# EAGLE design EEprom_Logger_V1_2019_11_11A (EAGLE 9.4.2)
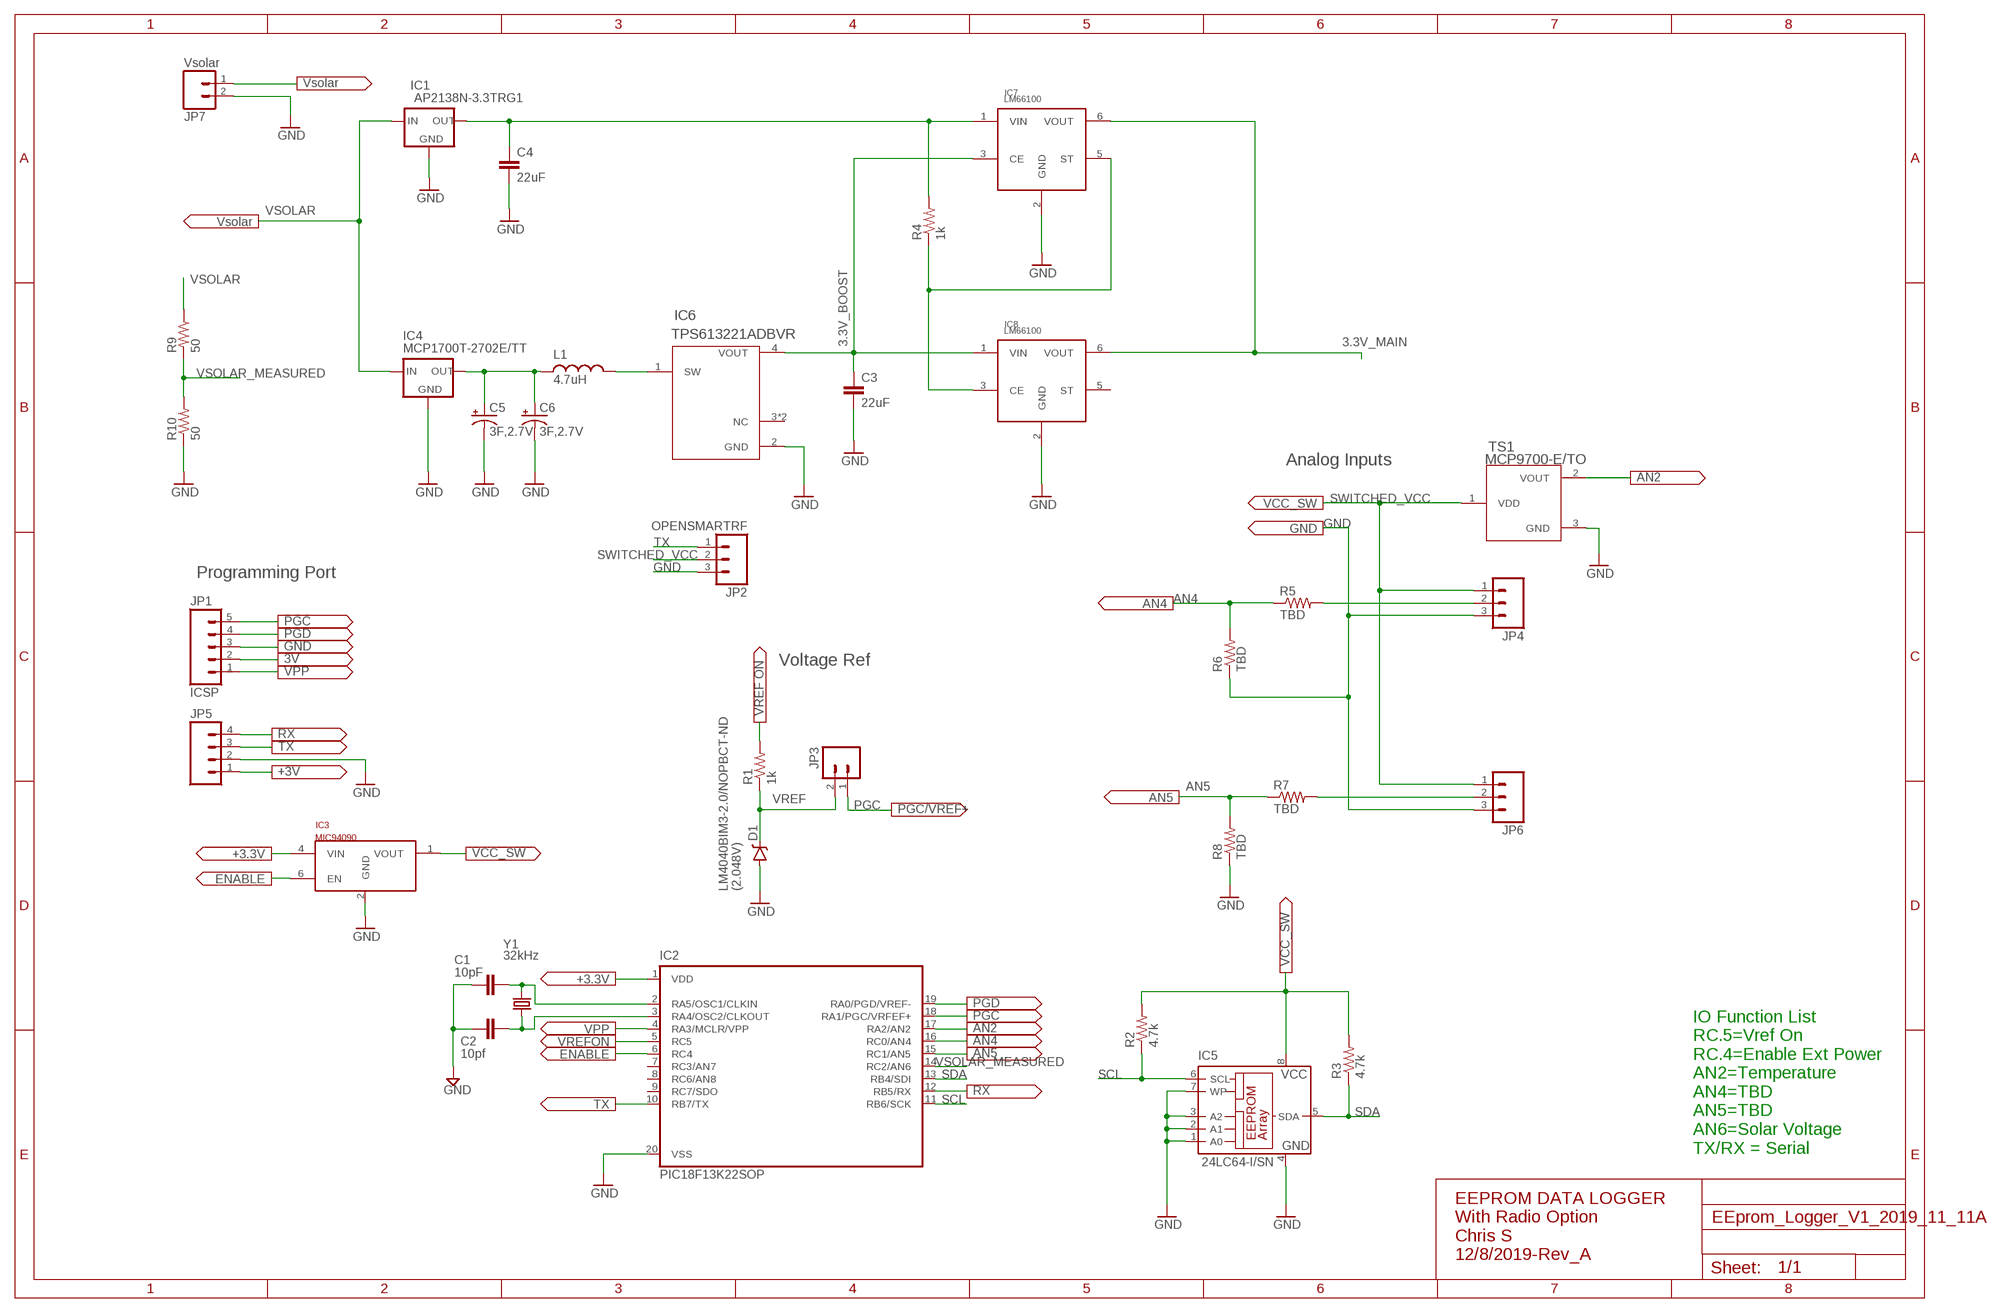
[diagram p0: schematic, sheet 1]

## Parts
C1  10pF  CAP1206  [1206]
C2  10pf  CAP1206  [1206]
C3  22uF  CAP1206  [1206]
C4  22uF  CAP1206  [1206]
C5  3F,2.7V  CPOL-USE3.5-8  [E3,5-8]
C6  3F,2.7V  CPOL-USE3.5-8  [E3,5-8]
D1  V-REFERENCESMD  [SOT23-3]
IC1  AP2138N-3.3TRG1  XC63FPM  [SOT23]
IC2  PIC18F13K22SOP  [SOP20W]
IC3  MIC94090  [SC-70]
IC4  MCP1700T-2702E/TT  XC63FPM  [SOT23]
IC5  24LC64-I/SN  24LC16BSN  [SO-08]
IC6  TPS613221ADBVR  TPS61322  [DBV5-L]
IC7  LM66100  [SC70-6]
IC8  LM66100  [SC70-6]
JP1  ICSP  M05PTH  [1X05]
JP2  OPENSMARTRF  M03LONGPADS  [1X03_LONGPADS@1]
JP3  M02LOCK  [1X02_LOCK]
JP4  455-1750-1-ND  CONN_03  [1X03]
JP5  M04PTH  [1X04]
JP6  455-1750-1-ND  CONN_03  [1X03]
JP7  Vsolar  CONN_02POLAR_LOCK  [MOLEX-1X2_LOCK@1]
L1  4.7uH  INDUCTOR1210  [1210]
R1  1k  RESISTOR1206  [1206]
R2  4.7k  RESISTOR1206  [1206]
R3  4.7k  RESISTOR1206  [1206]
R4  1k  RESISTOR1206  [1206]
R5  TBD  RESISTOR1206  [1206]
R6  TBD  RESISTOR1206  [1206]
R7  TBD  RESISTOR1206  [1206]
R8  TBD  RESISTOR1206  [1206]
R9  50  RESISTOR1206  [1206]
R10  50  RESISTOR1206  [1206]
TS1  MCP9700-E/TO  [TO-92-AMMO]
Y1  32kHz  CRYSTALTC26V  [TC26V]

## Nets
3.3V_BOOST: C3.2 IC6.4(VOUT) IC7.3(CE) IC8.1(VIN)
3.3V_MAIN: IC2.1(VDD) IC3.4(VIN) IC7.6(VOUT) IC8.6(VOUT) JP1.2 JP5.1
AN2: IC2.17(RA2/AN2) TS1.2(VOUT)
AN4: IC2.16(RC0/AN4) R5.1 R6.2
AN5: IC2.15(RC1/AN5) R7.1 R8.2
ENABLE: IC2.6(RC4) IC3.6(EN)
GND: C1.2 C2.2 C3.1 C4.1 C5.- C6.- D1.2(A) IC1.1(GND) IC2.20(VSS) IC3.2(GND) IC4.1(GND) IC5.1(A0) IC5.2(A1) IC5.3(A2) IC5.4(GND) IC5.7(WP) IC6.2(GND) IC7.2(GND) IC8.2(GND) JP1.3 JP2.3 JP4.3 JP5.2 JP6.3 JP7.2 R6.1 R8.1 R10.1 TS1.3(GND)
N$1: C1.1 IC2.2(RA5/OSC1/CLKIN) Y1.2
N$2: C2.1 IC2.3(RA4/OSC2/CLKOUT) Y1.1
N$3: C4.2 IC1.2(OUT) IC7.1(VIN) R4.2
N$4: C5.+ C6.+ IC4.2(OUT) L1.1
N$6: IC7.5(ST) IC8.3(CE) R4.1
N$7: JP4.2 R5.2
N$10: IC6.1(SW) L1.2
N$12: JP6.2 R7.2
PGC: IC2.18(RA1/PGC/VRFEF+) JP1.5 JP3.1
PGD: IC2.19(RA0/PGD/VREF-) JP1.4
RX: IC2.12(RB5/RX) JP5.4
SCL: IC2.11(RB6/SCK) IC5.6(SCL) R2.1
SDA: IC2.13(RB4/SDI) IC5.5(SDA) R3.1
SWITCHED_VCC: IC3.1(VOUT) IC5.8(VCC) JP2.2 JP4.1 JP6.1 R2.2 R3.2 TS1.1(VDD)
TX: IC2.10(RB7/TX) JP2.1 JP5.3
VPP: IC2.4(RA3/MCLR/VPP) JP1.1
VREF: D1.1(C) JP3.2 R1.1
VREFON: IC2.5(RC5) R1.2
VSOLAR: IC1.3(IN) IC4.3(IN) JP7.1 R9.1
VSOLAR_MEASURED: IC2.14(RC2/AN6) R9.2 R10.2
Unconnected: IC2.7(RC3/AN7) IC2.8(RC6/AN8) IC2.9(RC7/SDO) IC6.3(NC) IC6.5(NC) IC8.5(ST)

## Notes on the sheet
- Analog Inputs
- Programming Port
- Voltage Ref
- LM4040BIM3-2.0/NOPBCT-ND
  (2.048V)
- IO Function List
  RC.5=Vref On
  RC.4=Enable Ext Power
  AN2=Temperature
  AN4=TBD
  AN5=TBD
  AN6=Solar Voltage
  TX/RX = Serial
- EEPROM DATA LOGGER
  With Radio Option
  Chris S
  12/8/2019-Rev_A

## Library data of the parts
C1-C4 = SparkFun-Capacitors:CAP: Capacitor Standard 0603 ceramic capacitor, and 0.1" leaded capacitor.
C5 C6 = rcl:CPOL-US: POLARIZED CAPACITOR, American symbol; SPICEPREFIX: C
D1 = SparkFun-DiscreteSemi:V-REFERENCE: Zener diode
IC1 IC4 = v-reg:XC63FP: Positiv Voltage Regulators www.torex.co.jp/english/product/pro02/pdf/0201_xc62fp.pdf
IC2 = PIC18F13k22:PIC18F13K22?: 18/20/28-Pin High-Performance, Enhanced Flash Microcontrollers with 10-bit A/D and nanoWatt Technology Source: ww1.microchip.com/downloads/en/DeviceDoc/39605c.pdf
IC3 = MIC94090:MIC94090: MIC94090 Load switch 130mOhm ON 1.2A Conti. Current
IC5 = microchip:24*: Serial EEPROM I2C; MF: MICROCHIP; MPN: 24LC16B/SN; OC_FARNELL: 9757945; OC_NEWARK: 12C2012
IC6 = ‎TPS613221:TPS61322
IC7 IC8 = LM66100:LM66100
JP1 = SparkFun-Connectors:M05: Header 5 Standard 5-pin 0.1" header. Use with straight break away headers (SKU : PRT-00116), right angle break away headers (PRT-00553), swiss pins (PRT-00743), machine pins (PRT-00117), and female headers (PRT-00115). Molex polarized connector foot print use with SKU : PRT-08230 with associated crimp pins and housings.
JP2 = SparkFun-Connectors:M03: Header 3 Standard 3-pin 0.1" header. Use with straight break away headers (SKU : PRT-00116), right angle break away headers (PRT-00553), swiss pins (PRT-00743), machine pins (PRT-00117), and female headers (PRT-00115). Molex polarized connector foot print use with SKU : PRT-08232 with associated crimp pins and housings.
JP3 = SparkFun-Connectors:M02: Standard 2-pin 0.1" header. Use with - straight break away headers ( PRT-00116) - right angle break away headers (PRT-00553) - swiss pins (PRT-00743) - machine pins (PRT-00117) - female headers (PRT-00115) Molex polarized connector foot print use with: PRT-08233 with associated crimp pins and housings. 2.54_SCREWTERM for use with PRT-10571. 3.5mm Screw Terminal footprints for PRT-08084 5mm Screw Terminal footprints for use with PRT-08432
JP4 JP6 = SparkFun-Connectors:CONN_03: Multi connection point. Often used as Generic Header-pin footprint for 0.1 inch spaced/style header connections On any of the 0.1 inch spaced packages, you can populate with these: Break Away Headers - Straight <https://www.sparkfun.com/products/116> (PRT-00116) Break Away Male Headers - Right Angle <https://www.sparkfun.com/products/553> (PRT-00553) Female Headers <https://www.sparkfun.com/products/115> (PRT-00115) Break Away Headers - Machine Pin <https://www.sparkfun.com/products/117> (PRT-00117) Break Away Female Headers - Swiss Machine Pin <https://www.sparkfun.com/products/743> (PRT-00743) Stackable Header - 3 Pin (Female, 0.1") <https://www.sparkfun.com/products/13875> (PRT-13875) For SCREWTERMINALS and SPRING TERMINALS visit here: Screw Terimnals on SparkFun.com <https://www.sparkfun.com/search/results?term=Screw+Terminals> (5mm/3.5mm/2.54mm spacing) This device is also useful as a general connection point to wire up your design to another part of your project. Our various solder wires solder well into these plated through hole pads. Hook-Up Wire - Assortment (Stranded, 22 AWG) <https://www.sparkfun.com/products/11375> (PRT-11375) Hook-Up Wire - Assortment (Solid Core, 22 AWG) <https://www.sparkfun.com/products/11367> (PRT-11367) View the entire wire category on our website here <https://www.sparkfun.com/categories/141> Special notes: Molex polarized connector foot print use with SKU : PRT-08232 with associated crimp pins and housings.; PROD_ID: XXX-00000
JP5 = SparkFun-Connectors:M04: Header 4 Standard 4-pin 0.1" header. Use with straight break away headers (SKU : PRT-00116), right angle break away headers (PRT-00553), swiss pins (PRT-00743), machine pins (PRT-00117), and female headers (PRT-00115). Molex polarized connector foot print use with SKU : PRT-08231 with associated crimp pins and housings. 1MM SMD Version SKU: PRT-10208
JP7 = SparkFun-Connectors:CONN_02: Multi connection point. Often used as Generic Header-pin footprint for 0.1 inch spaced/style header connections On any of the 0.1 inch spaced packages, you can populate with these: Break Away Headers - Straight <https://www.sparkfun.com/products/116> (PRT-00116) Break Away Male Headers - Right Angle <https://www.sparkfun.com/products/553> (PRT-00553) Female Headers <https://www.sparkfun.com/products/115> (PRT-00115) Break Away Headers - Machine Pin <https://www.sparkfun.com/products/117> (PRT-00117) Break Away Female Headers - Swiss Machine Pin <https://www.sparkfun.com/products/743> (PRT-00743) For SCREWTERMINALS and SPRING TERMINALS visit here: Screw Terimnals on SparkFun.com <https://www.sparkfun.com/search/results?term=Screw+Terminals> (5mm/3.5mm/2.54mm spacing) This device is also useful as a general connection point to wire up your design to another part of your project. Our various solder wires solder well into these plated through hole pads. Hook-Up Wire - Assortment (Stranded, 22 AWG) <https://www.sparkfun.com/products/11375> (PRT-11375) Hook-Up Wire - Assortment (Solid Core, 22 AWG) <https://www.sparkfun.com/products/11367> (PRT-11367) View the entire wire category on our website here <https://www.sparkfun.com/categories/141> Special notes: Molex polarized connector foot print use with: PRT-08233 with associated crimp pins and housings. 2.54_SCREWTERM for use with PRT-10571. 3.5mm Screw Terminal footprints for PRT-08084 5mm Screw Terminal footprints for use with PRT-08432; SF_ID: PRT-09918
L1 = SparkFun-Passives:INDUCTOR: Inductors Basic Inductor/Choke - 0603 and 1206. Footprints are not proven and vary greatly between part numbers. SRN6045- 33uH, 20% 1.4A SDR0403-560KL - 56uH, 10%, 500mA RMS/740mA peak
R1-R10 = SparkFun-Resistors:RESISTOR: Resistor Basic schematic elements and footprints for 0603, 1206, and PTH resistors.
TS1 = MCP970X_Temp Sensors:MCP9700-E/TO
Y1 = crystal:CRYSTAL: CRYSTAL; OC_FARNELL: unknown; OC_NEWARK: unknown

## Board
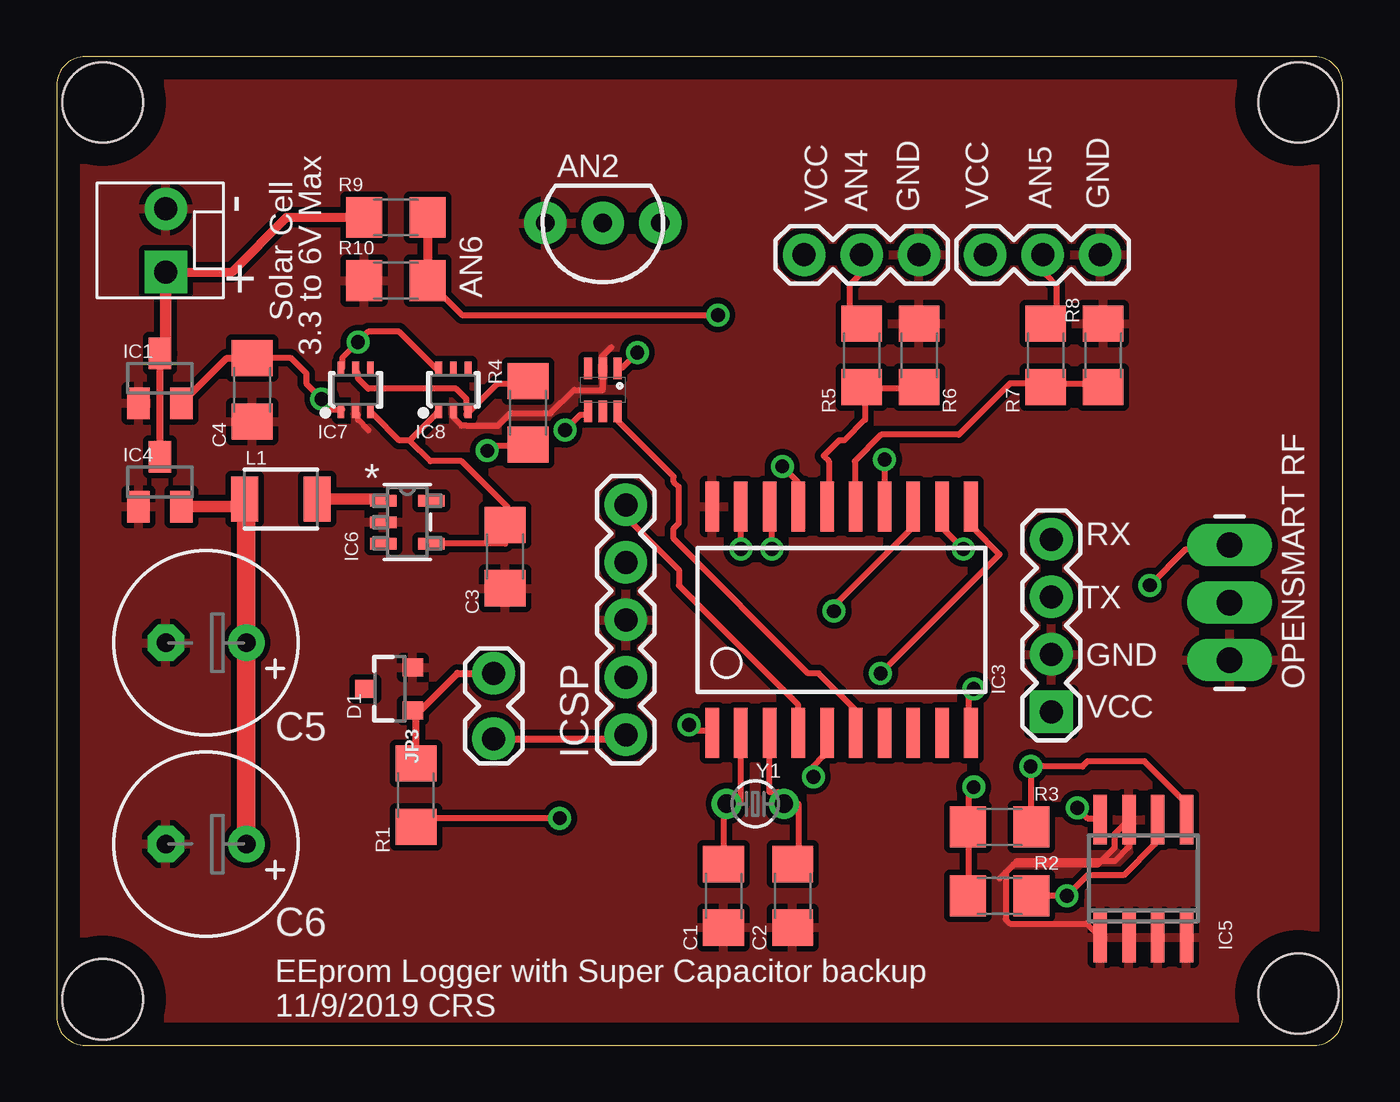
[diagram p1: board, top side]
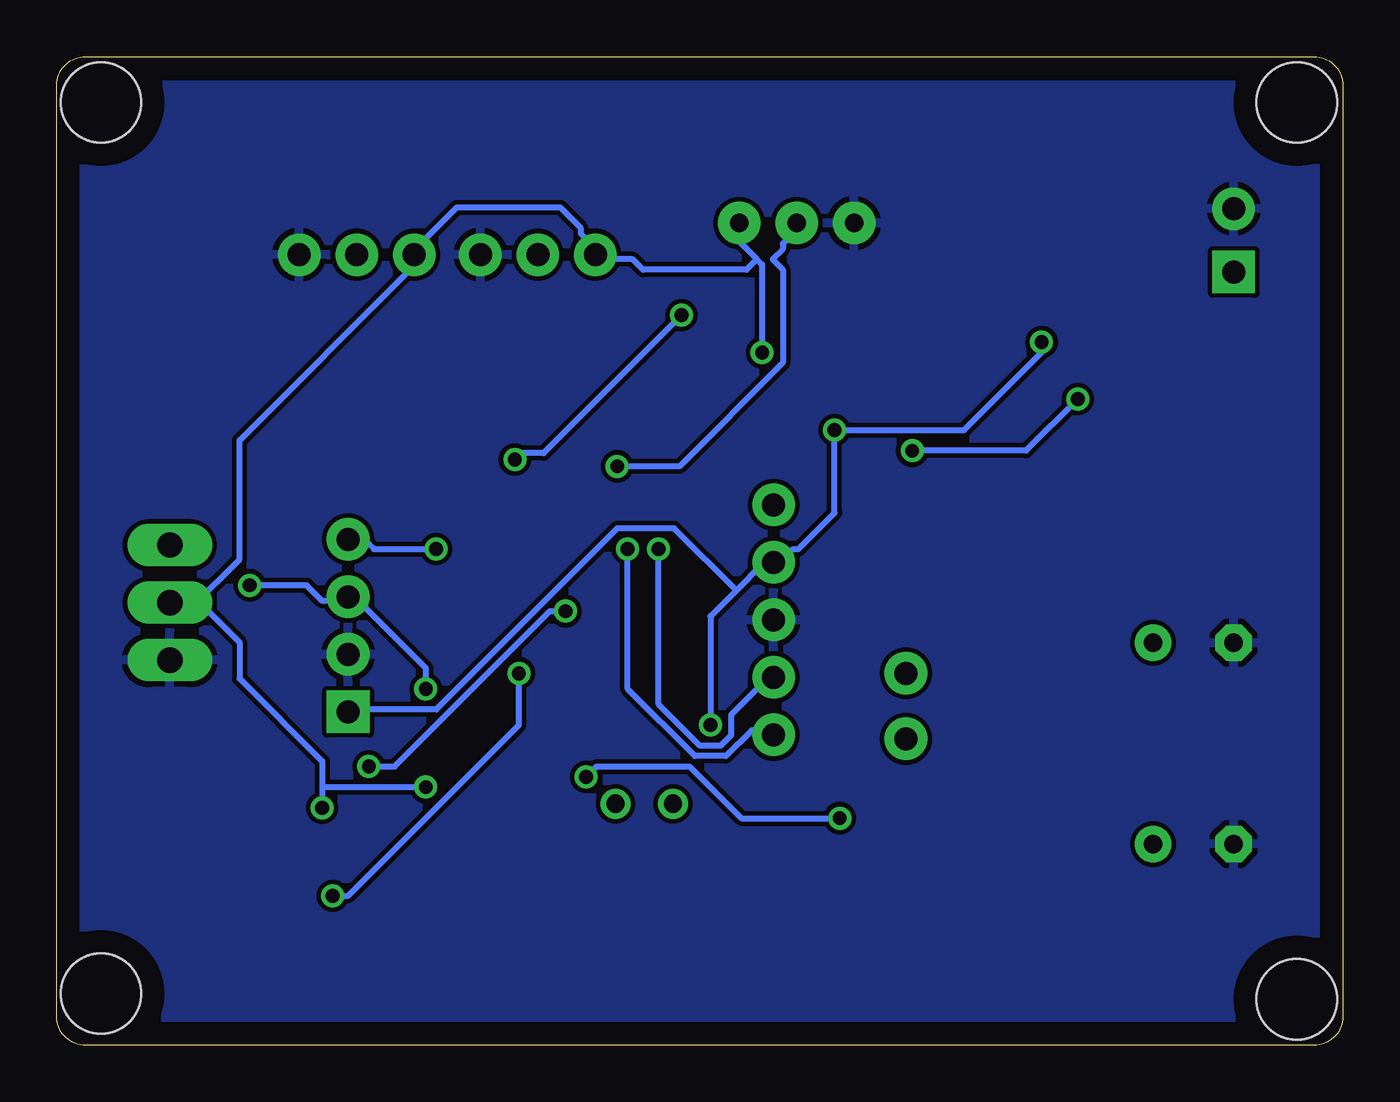
[diagram p2: board, bottom side, seen from below]

Size 56.82 x 43.68 mm. Coordinates in mm from the lower left corner, seen from the top.
Outline: 0,42.41 0,1.27 arc90 1.27,0 55.55,0 arc90 56.82,1.27 56.82,42.41 arc90 55.55,43.68 1.27,43.68 arc90 0,42.41
Copper layers (1*16): Top 0.035mm / dielectric 1.5mm / Bottom 0.035mm
Design rules "default": minimum track width 10mil, minimum drill 24mil, track to track 8mil, track to pad 8mil, pad to pad 8mil, via to via 8mil, smd to smd 8mil, copper to edge 40mil, drill to drill 8mil, minimum pad ring 10mil, minimum via ring 8mil, stop-mask expansion 4mil, vias tented up to drill 0mil, thermal gap 10mil
Holes 3.56 mm at 2.03,41.66 54.86,41.66 54.86,2.29 2.03,2.03

### Footprints (pad centres in the part's own frame; a part is rotated, then mirrored left to right if it is on the bottom)
1206 = smd 1.6 x 1.8: 1 -1.4,0; 2 1.4,0
E3,5-8 = drill 0.813 pad 1.6: + -1.778,0 | drill 0.813 pad 1.6 octagon: - 1.778,0
SOT23-3 = smd 0.8 x 0.9: 1 -0.95,-1; 2 0.95,-1; 3 0,1.1
SOT23 = smd 1 x 1.4: 1 -0.95,-1.1; 2 0.95,-1.1; 3 0,1.1
SOP20W = smd 0.6 x 2.2: 1 -5.715,-5; 2 -4.445,-5; 3 -3.175,-5; 4 -1.905,-5; 5 -0.635,-5; 6 0.635,-5; 7 1.905,-5; 8 3.175,-5; 9 4.445,-5; 10 5.715,-5; 11 5.715,5; 12 4.445,5; 13 3.175,5; 14 1.905,5; 15 0.635,5; 16 -0.635,5; 17 -1.905,5; 18 -3.175,5; 19 -4.445,5; 20 -5.715,5
SC-70 = smd 0.36 x 0.95: 1 -0.65,-0.95; 2 0,-0.95; 3 0.65,-0.95; 4 0.65,0.95; 5 0,0.95; 6 -0.65,0.95
SO-08 = smd 0.6 x 2.2: 1 -1.905,-2.6; 2 -0.635,-2.6; 3 0.635,-2.6; 4 1.905,-2.6; 5 1.905,2.6; 6 0.635,2.6; 7 -0.635,2.6; 8 -1.905,2.6
DBV5-L = smd 1.168 x 0.508: 1 -1.067,0.95; 2 -1.067,0; 3 -1.067,-0.95; 4 1.067,-0.95; 5 1.067,0.95
SC70-6 = smd 0.3 x 0.66: 1 -0.65,-0.92; 2 0,-0.92; 3 0.65,-0.92; 4 0.65,0.92; 5 0,0.92; 6 -0.65,0.92
1X05 = drill 1.016 pad 1.88: 1 0,0; 2 2.54,0; 3 5.08,0; 4 7.62,0; 5 10.16,0
1X03_LONGPADS@1 = drill 1.118 pad 1.88 long: 1 0,0; 2 2.54,0; 3 5.08,0
1X02_LOCK = drill 1.016 pad 1.88: 1 -0.178,0; 2 2.718,0
1X03 = drill 1.016 pad 1.88: 1 0,0; 2 2.54,0; 3 5.08,0
1X04 = drill 1.016 pad 1.88 square: 1 0,0 | drill 1.016 pad 1.88: 2 2.54,0; 3 5.08,0; 4 7.62,0
MOLEX-1X2_LOCK@1 = drill 1.016 pad 1.88 square: 1 -0.127,0 | drill 1.016 pad 1.88: 2 2.667,0
1210 = smd 1.2 x 2: 1 -1.6,0; 2 1.6,0
TO-92-AMMO = drill 0.813 pad 1.88: 1 -2.54,0; 2 0,0; 3 2.54,0
TC26V = drill 0.813: 1 -1.27,0; 2 1.27,0

### Placement (x,y rotation side)
C1  29.46,6.6 270 top
C2  32.51,6.6 270 top
C3  19.81,21.59 90 top
C4  8.64,28.96 90 top
C5  6.6,17.78 180 top
C6  6.6,8.89 180 top
D1  14.73,15.75 90 top
IC1  4.57,29.46 0 top
IC2  34.67,18.8 0 top
IC3  24.13,28.96 180 top
IC4  4.57,24.89 0 top
IC5  48.01,7.37 0 top
IC6  15.49,23.11 0 top
IC7  13.21,28.96 0 top
IC8  17.53,28.96 0 top
JP1  25.15,23.88 270 top
JP2  51.82,22.1 270 top
JP3  19.3,13.72 90 top
JP4  33.02,34.93 0 top
JP5  43.94,14.73 90 top
JP6  41.02,34.93 0 top
JP7  4.83,34.29 90 top
L1  9.91,24.13 0 top
R1  15.87,11.05 270 top
R2  41.66,6.6 180 top
R3  41.66,9.65 180 top
R4  20.83,27.94 270 top
R5  35.56,30.48 90 top
R6  38.1,30.48 270 top
R7  43.69,30.48 90 top
R8  46.23,30.48 270 top
R9  14.99,36.58 0 top
R10  14.99,33.78 0 top
TS1  24.13,36.32 180 top
Y1  30.86,10.67 180 top

### Tracks (layer width: path | path; a pad name or v marks a point on that pad's centre or on a via)
3.3V_BOOST
  Top 0.254: IC6.4 19.81,22.16 C3.2 19.94,23.06 19.94,23.75 17.88,25.81 16.51,25.81 15.6,26.72 | 15.6,26.72 15.14,26.72 13.99,27.86 IC7.3 | 15.6,26.72 16.74,27.86 IC8.1
3.3V_MAIN  (via drill 0.61)
  Top 0.254: IC7.6 12.62,29.92 12.62,30.38 v13.31,31.06 13.77,31.52 15.14,31.52 16.74,29.92 IC8.6 | v22.45,27.18 23.14,27.86 23.37,27.86 IC3.4 | v27.94,14.15 28.17,13.92 28.85,13.92 IC2.1
  Bottom 0.254: v27.94,14.15 27.94,18.95 26.8,20.09 | 26.8,20.09 25.65,21.23 25.2,21.23 JP1.2 24.97,21.23 24.28,21.92 24.05,21.92 22.45,23.52 v22.45,27.18 16.74,27.18 13.08,30.84 13.08,31.06 v13.31,31.06 | 26.8,20.09 29.54,22.84 32.05,22.84 40.06,14.83 43.94,14.83 JP5.1
AN2  (via drill 0.61)
  Top 0.254: v32.05,25.58 32.74,24.89 32.74,23.98 IC2.17
  Bottom 0.254: v32.05,25.58 29.31,25.58 24.74,30.15 24.74,34.27 25.2,34.72 24.74,35.18 24.74,35.41 24.28,35.87 24.28,36.32 TS1.2
AN4
  Top 0.254: 35.71,29.01 38,29.01 R6.2 | 35.71,29.01 R5.1 35.71,29.01 | 35.71,29.01 35.71,27.63 34.8,26.72 34.57,26.72 33.88,26.04 34.11,25.81 34.11,23.98 IC2.16
AN5
  Top 0.254: R8.2 46.23,29.21 43.71,29.21 R7.1 43.48,29.23 42.11,29.23 39.85,26.98 36.42,26.98 35.26,25.81 35.26,23.98 IC2.15
ENABLE
  Top 0.254: IC3.6 24.74,27.86 24.74,27.63 27.25,25.12 27.25,24.89 27.48,24.66 27.48,23.06 27.25,22.84 27.25,22.38 33.2,16.43 33.66,16.43 35.26,14.83 35.26,13.92 IC2.6
GND
  Top 0.254: 13.77,27.18 13.31,27.63 13.31,27.86 IC7.2 | 24.51,30.84 24.05,30.38 24.05,29.92 IC3.2 24.13,28.96 22.86,28.96 21.83,27.92 20.05,27.92 19.5,27.38 18.14,27.38 18.12,27.37 18.11,27.38 17.89,27.38 17.53,27.74 IC8.2 | 41.66,7.37 42.41,8.13 46.74,8.13 47.37,8.76 IC5.7 46.73,9.33 46.73,8.73 45.98,7.98 42.26,7.98 41.93,7.64 41.93,5.57 42.12,5.37 45.49,5.37 IC5.1
  pour Top (isolate 0.254): -4.06,45.97 73.15,45.97 73.15,-1.02 -4.06,-1.02
  pour Bottom: -2.29,42.93 62.74,42.93 62.74,-6.6 -2.29,-6.6
N$1
  Top 0.254: IC2.2 30.23,10.67 Y1.2 29.46,10.67 C1.1
N$2
  Top 0.254: IC2.3 31.5,11.18 32.13,11.18 Y1.1 32.77,10.67 32.77,8 C2.1
N$3  (via drill 0.61)
  Top 0.254: IC7.1 12.62,28.09 12.17,28.09 v11.71,28.55 11.02,29.23 11.02,29.69 10.34,30.38 8.74,30.38 C4.2 | v19.02,26.26 19.25,26.49 20.62,26.49 R4.2
  Top 0.305: IC1.2 7.51,30.36 C4.2
  Bottom 0.254: v19.02,26.26 13.99,26.26 v11.71,28.55
N$4
  Top 0.508: L1.1 8.31,23.79 IC4.2
  Top 0.813: L1.1 8.38,24.05 C5.+ C6.+
N$6
  Top 0.254: IC7.5 13.31,29.69 13.31,29.46 13.77,29.01 17.65,29.01 18.11,28.55 18.11,28.09 IC8.3 18.11,27.86 19.48,29.23 20.62,29.23 R4.1
N$7
  Top 0.254: R5.2 35.48,31.98 35.03,32.44 35.03,33.58 35.48,34.04 35.48,34.72 JP4.2
N$10
  Top 0.508: IC6.1 14.43,24.13 L1.2
N$12
  Top 0.254: R7.2 43.71,31.98 44.17,32.44 44.17,33.58 43.71,34.04 43.71,34.72 JP6.2
PGC  (via drill 0.61)
  Top 0.254: v31.6,21.92 31.6,23.75 IC2.18
  Top 0.305: JP3.1 24.97,13.54 JP1.5
  Bottom 0.254: v31.6,21.92 31.6,15.75 28.63,12.78 27.25,12.78 26.11,13.92 25.2,13.92 JP1.5
PGD  (via drill 0.61)
  Top 0.254: v30.23,21.92 30.23,23.75 IC2.19
  Bottom 0.254: v30.23,21.92 30.23,15.06 28.4,13.23 27.48,13.23 27.03,13.69 27.03,14.6 25.2,16.43 JP1.4
RX  (via drill 0.61)
  Top 0.254: v40.06,21.92 39.14,22.84 39.14,23.75 IC2.12
  Bottom 0.254: v40.06,21.92 42.8,21.92 43.03,22.15 43.94,22.15 JP5.4
SCL  (via drill 0.61)
  Top 0.254: R2.1 43.26,6.6 v44.63,6.6 45.54,7.52 47.14,7.52 48.51,8.89 48.51,9.8 IC5.6 | v36.4,16.43 41.66,21.69 40.51,22.84 40.51,23.75 IC2.11
  Bottom 0.254: v36.4,16.43 36.4,14.15 43.94,6.6 v44.63,6.6
SDA  (via drill 0.61)
  Top 0.254: 43.26,12.09 43.48,12.32 45.31,12.32 45.54,12.55 48.06,12.55 49.89,10.72 49.89,10.03 IC5.5 | 43.26,12.09 43.03,11.86 43.03,9.8 R3.1 | v34.34,19.18 34.34,19.41 37.77,22.84 37.77,23.75 IC2.13 | 43.26,12.09 v43.03,12.32
  Bottom 0.254: v34.34,19.18 35.03,19.18 41.89,12.32 v43.03,12.32
SWITCHED_VCC  (via drill 0.61)
  Top 0.254: v25.65,30.61 24.97,29.92 24.74,29.92 IC3.1 | R2.2 40.28,6.6 40.28,9.58 R3.2 40.28,9.8 40.28,11.18 v40.51,11.4 | v45.09,10.49 45.54,10.03 46,10.03 IC5.8
  Bottom 0.254: v25.65,30.61 25.65,34.49 25.88,34.72 | 25.88,34.72 26.57,35.41 26.57,36.32 TS1.1 | 25.88,34.72 26.34,34.27 30.91,34.27 31.37,34.72 32.97,34.72 JP4.1 33.2,34.95 33.2,35.41 33.66,35.87 33.66,36.09 34.57,37.01 39.14,37.01 40.51,35.64 40.51,35.41 40.97,34.95 JP6.1 41.2,34.72 41.2,34.27 48.74,26.72 48.74,21.46 50.8,19.41 | 45.09,11.4 45.09,12.55 48.74,16.2 48.74,17.8 50.34,19.41 50.8,19.41 | 45.09,11.4 v45.09,10.49 | 50.8,19.41 51.71,19.41 JP2.2 | 45.09,11.4 v40.51,11.4
TX  (via drill 0.61)
  Top 0.254: v40.51,15.75 40.28,15.52 40.28,13.92 IC2.10 | v48.29,20.32 49.89,21.92 51.71,21.92 JP2.1
  Bottom 0.254: v40.51,15.75 40.51,16.66 43.48,19.63 43.94,19.63 | 43.94,19.63 JP5.3 43.94,19.63 | v48.29,20.32 45.77,20.32 45.09,19.63 43.94,19.63
VPP
  Top 0.254: IC2.4 32.74,13.92 32.74,15.06 27.48,20.32 27.48,21.01 25.2,23.29 25.2,23.75 JP1.1
VREF
  Top 0.254: R1.1 15.87,14.65 D1.1
  Top 0.305: R1.1 15.87,14.6 17.7,16.43 JP3.2
VREFON  (via drill 0.61)
  Top 0.254: v22.23,10.03 16.4,10.03 R1.2 | v33.43,11.86 33.43,12.32 33.88,12.78 33.88,13.69 IC2.5
  Bottom 0.254: v22.23,10.03 26.57,10.03 28.85,12.32 32.97,12.32 v33.43,11.86
VSOLAR
  Top 0.305: IC4.3 IC1.3
  Top 0.406: JP7.1 7.75,34.16 10.16,36.58 R9.1
  Top 0.508: IC1.3 4.83,30.56 JP7.1
VSOLAR_MEASURED  (via drill 0.61)
  Top 0.254: R10.2 17.91,32.26 v29.21,32.26 | v36.58,25.88 IC2.14
  Top 0.406: R9.2 R10.2
  Bottom 0.254: v29.21,32.26 35.31,26.16 36.58,26.16 v36.58,25.88

### Text on the board
tPlace: RX | TX | GND | OPENSMART RF | VCC
tNames: - | AN2 | VCC | AN4 | GND | VCC | AN5 | GND | + | AN6 | Solar Cell | 3.3 to 6V Max | IC3 | EEprom Logger with Super Capacitor backup / 11/9/2019 CRS